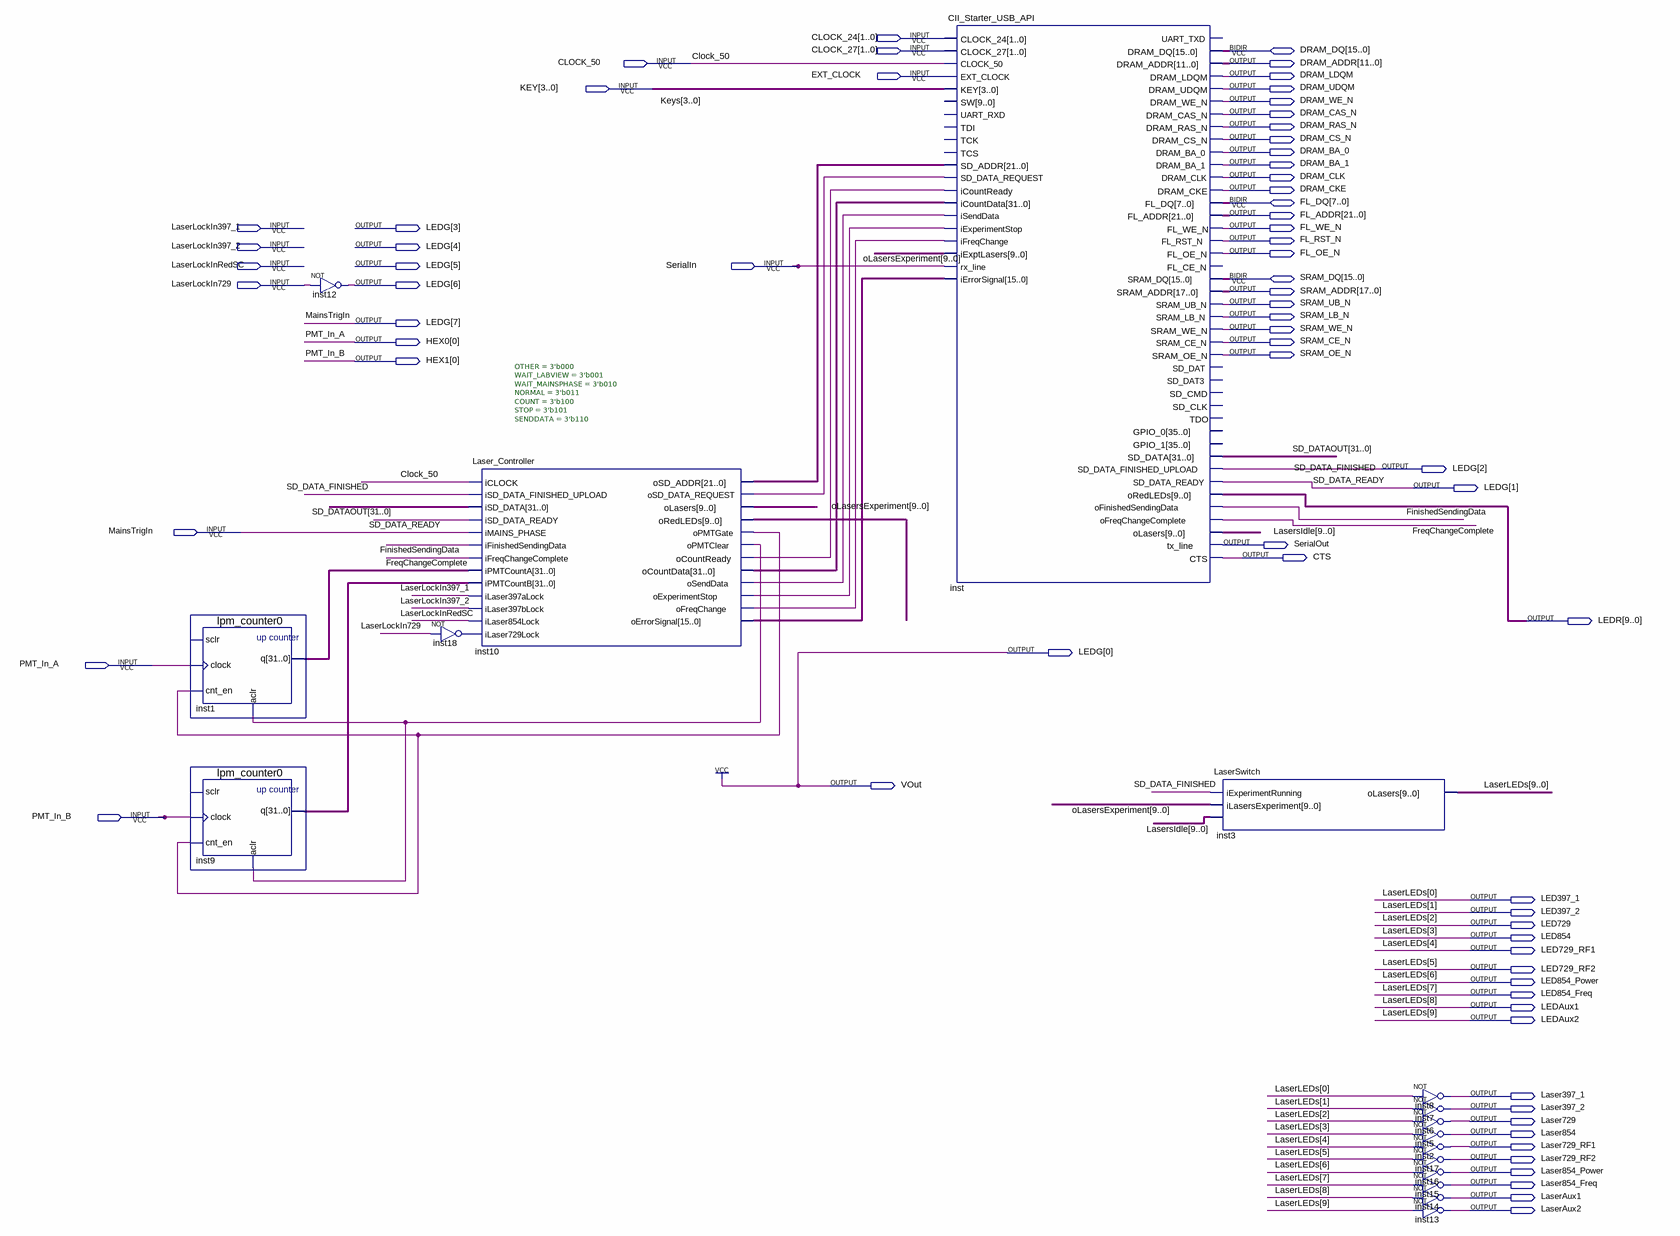
[diagram p0: schematic sheet]
// Quartus schematic CPU.bdf as structural Verilog: 17 symbols, 71 pins
module CPU (
  input  [1:0] CLOCK_24,
  input  [1:0] CLOCK_27,
  input  CLOCK_50,
  input  EXT_CLOCK,
  input  [3:0] KEY,
  input  LaserLockIn397_1,
  input  LaserLockIn397_2,
  input  LaserLockInRedSC,
  input  SerialIn,
  input  LaserLockIn729,
  input  MainsTrigIn,
  input  PMT_In_A,
  input  PMT_In_B,
  inout  [15:0] DRAM_DQ,
  inout  [7:0] FL_DQ,
  inout  [15:0] SRAM_DQ,
  output [11:0] DRAM_ADDR,
  output DRAM_LDQM,
  output DRAM_UDQM,
  output DRAM_WE_N,
  output DRAM_CAS_N,
  output DRAM_RAS_N,
  output DRAM_CS_N,
  output DRAM_BA_0,
  output DRAM_BA_1,
  output DRAM_CLK,
  output DRAM_CKE,
  output [21:0] FL_ADDR,
  output [7:0] LEDG,
  output FL_WE_N,
  output FL_RST_N,
  output FL_OE_N,
  output [17:0] SRAM_ADDR,
  output SRAM_UB_N,
  output SRAM_LB_N,
  output SRAM_WE_N,
  output [0:0] HEX0,
  output SRAM_CE_N,
  output SRAM_OE_N,
  output [0:0] HEX1,
  output SerialOut,
  output CTS,
  output [9:0] LEDR,
  output VOut,
  output LED397_1,
  output LED397_2,
  output LED729,
  output LED854,
  output LED729_RF1,
  output LED729_RF2,
  output LED854_Power,
  output LED854_Freq,
  output LEDAux1,
  output LEDAux2,
  output Laser397_1,
  output Laser397_2,
  output Laser729,
  output Laser854,
  output Laser729_RF1,
  output Laser729_RF2,
  output Laser854_Power,
  output Laser854_Freq,
  output LaserAux1,
  output LaserAux2
);

  wire FinishedSendingData, FreqChangeComplete, inst10_ocountready, inst10_oexperimentstop,
       inst10_ofreqchange, inst10_opmtclear, inst10_opmtgate, inst10_osd_data_request, inst10_osenddata,
       inst18_out;
  wire [9:0] inst10_oredleds, LasersIdle, oLasersExperiment;
  wire [15:0] inst10_oerrorsignal;
  wire [21:0] inst10_osd_addr;
  wire [31:0] inst1_q, inst9_q, inst10_ocountdata, SD_DATAOUT;

  lpm_counter0 inst1 (.clock(PMT_In_A), .cnt_en(inst10_opmtgate), .aclr(inst10_opmtclear), .q(inst1_q));  // open: sclr
  lpm_counter0 inst9 (.clock(PMT_In_B), .cnt_en(inst10_opmtgate), .aclr(inst10_opmtclear), .q(inst9_q));  // open: sclr
  not inst12 (LEDG[6], LaserLockIn729);
  not inst18 (inst18_out, LaserLockIn729);
  Laser_Controller #(.OTHER(3'b000), .WAIT_LABVIEW(3'b001), .WAIT_MAINSPHASE(3'b010), .NORMAL(3'b011), .COUNT(3'b100), .STOP(3'b101), .SENDDATA(3'b110)) inst10 (
    .iCLOCK(CLOCK_50), .iSD_DATA_FINISHED_UPLOAD(LEDG[2]), .iSD_DATA(SD_DATAOUT), .iSD_DATA_READY(LEDG[1]),
    .iMAINS_PHASE(MainsTrigIn), .iFinishedSendingData(FinishedSendingData),
    .iFreqChangeComplete(FreqChangeComplete), .iPMTCountA(inst1_q), .iPMTCountB(inst9_q),
    .iLaser397aLock(LaserLockIn397_1), .iLaser397bLock(LaserLockIn397_2), .iLaser854Lock(LaserLockInRedSC),
    .iLaser729Lock(inst18_out), .oSD_ADDR(inst10_osd_addr), .oSD_DATA_REQUEST(inst10_osd_data_request),
    .oRedLEDs(inst10_oredleds), .oPMTGate(inst10_opmtgate), .oPMTClear(inst10_opmtclear),
    .oCountReady(inst10_ocountready), .oCountData(inst10_ocountdata), .oSendData(inst10_osenddata),
    .oExperimentStop(inst10_oexperimentstop), .oFreqChange(inst10_ofreqchange),
    .oErrorSignal(inst10_oerrorsignal), .oLasers(oLasersExperiment));
  CII_Starter_USB_API inst (
    .CLOCK_24(CLOCK_24), .CLOCK_27(CLOCK_27), .CLOCK_50(CLOCK_50), .EXT_CLOCK(EXT_CLOCK), .KEY(KEY),
    .SD_ADDR(inst10_osd_addr), .SD_DATA_REQUEST(inst10_osd_data_request), .iCountReady(inst10_ocountready),
    .iCountData(inst10_ocountdata), .iSendData(inst10_osenddata), .iExperimentStop(inst10_oexperimentstop),
    .iFreqChange(inst10_ofreqchange), .rx_line(SerialIn), .iErrorSignal(inst10_oerrorsignal),
    .iExptLasers(oLasersExperiment), .DRAM_ADDR(DRAM_ADDR), .DRAM_LDQM(DRAM_LDQM), .DRAM_UDQM(DRAM_UDQM),
    .DRAM_WE_N(DRAM_WE_N), .DRAM_CAS_N(DRAM_CAS_N), .DRAM_RAS_N(DRAM_RAS_N), .DRAM_CS_N(DRAM_CS_N),
    .DRAM_BA_0(DRAM_BA_0), .DRAM_BA_1(DRAM_BA_1), .DRAM_CLK(DRAM_CLK), .DRAM_CKE(DRAM_CKE),
    .FL_ADDR(FL_ADDR), .FL_WE_N(FL_WE_N), .FL_RST_N(FL_RST_N), .FL_OE_N(FL_OE_N), .SRAM_ADDR(SRAM_ADDR),
    .SRAM_UB_N(SRAM_UB_N), .SRAM_LB_N(SRAM_LB_N), .SRAM_WE_N(SRAM_WE_N), .SRAM_CE_N(SRAM_CE_N),
    .SRAM_OE_N(SRAM_OE_N), .SD_DATA(SD_DATAOUT), .SD_DATA_FINISHED_UPLOAD(LEDG[2]), .SD_DATA_READY(LEDG[1]),
    .oRedLEDs(LEDR), .oFinishedSendingData(FinishedSendingData), .oFreqChangeComplete(FreqChangeComplete),
    .tx_line(SerialOut), .CTS(CTS), .oLasers(LasersIdle), .DRAM_DQ(DRAM_DQ), .FL_DQ(FL_DQ), .SRAM_DQ(SRAM_DQ));  // open: SW, UART_RXD, TDI, TCK, TCS, UART_TXD, FL_CE_N, SD_CLK, TDO, SD_DAT, SD_DAT3, SD_CMD, GPIO_0, GPIO_1
  LaserSwitch inst3 (
    .iExperimentRunning(LEDG[2]), .iLasersExperiment(oLasersExperiment), .iLasersIdle(LasersIdle),
    .oLasers({LEDAux2, LEDAux1, LED854_Freq, LED854_Power, LED729_RF2, LED729_RF1, LED854, LED729, LED397_2, LED397_1}));
  not inst8 (Laser397_1, LED397_1);
  not inst7 (Laser397_2, LED397_2);
  not inst6 (Laser729, LED729);
  not inst5 (Laser854, LED854);
  not inst2 (Laser729_RF1, LED729_RF1);
  not inst17 (Laser729_RF2, LED729_RF2);
  not inst16 (Laser854_Power, LED854_Power);
  not inst15 (Laser854_Freq, LED854_Freq);
  not inst14 (LaserAux1, LEDAux1);
  not inst13 (LaserAux2, LEDAux2);

  assign HEX0[0] = PMT_In_A;
  assign HEX1[0] = PMT_In_B;
  assign {LEDG[7], LEDG[0]} = {MainsTrigIn, 1'b1};
  assign VOut = 1'b1;

  // Other names for the same wires on the sheet: Keys[3:0] = KEY;
  //   LaserLEDs[9:0] = {LEDAux2, LEDAux1, LED854_Freq, LED854_Power, LED729_RF2, LED729_RF1, LED854, LED729, LED397_2, LED397_1};
  //   SD_DATA_FINISHED = LEDG[2]; SD_DATA_READY = LEDG[1]
endmodule
